# EAGLE design GS1011MWriter (EAGLE 6.5.0)
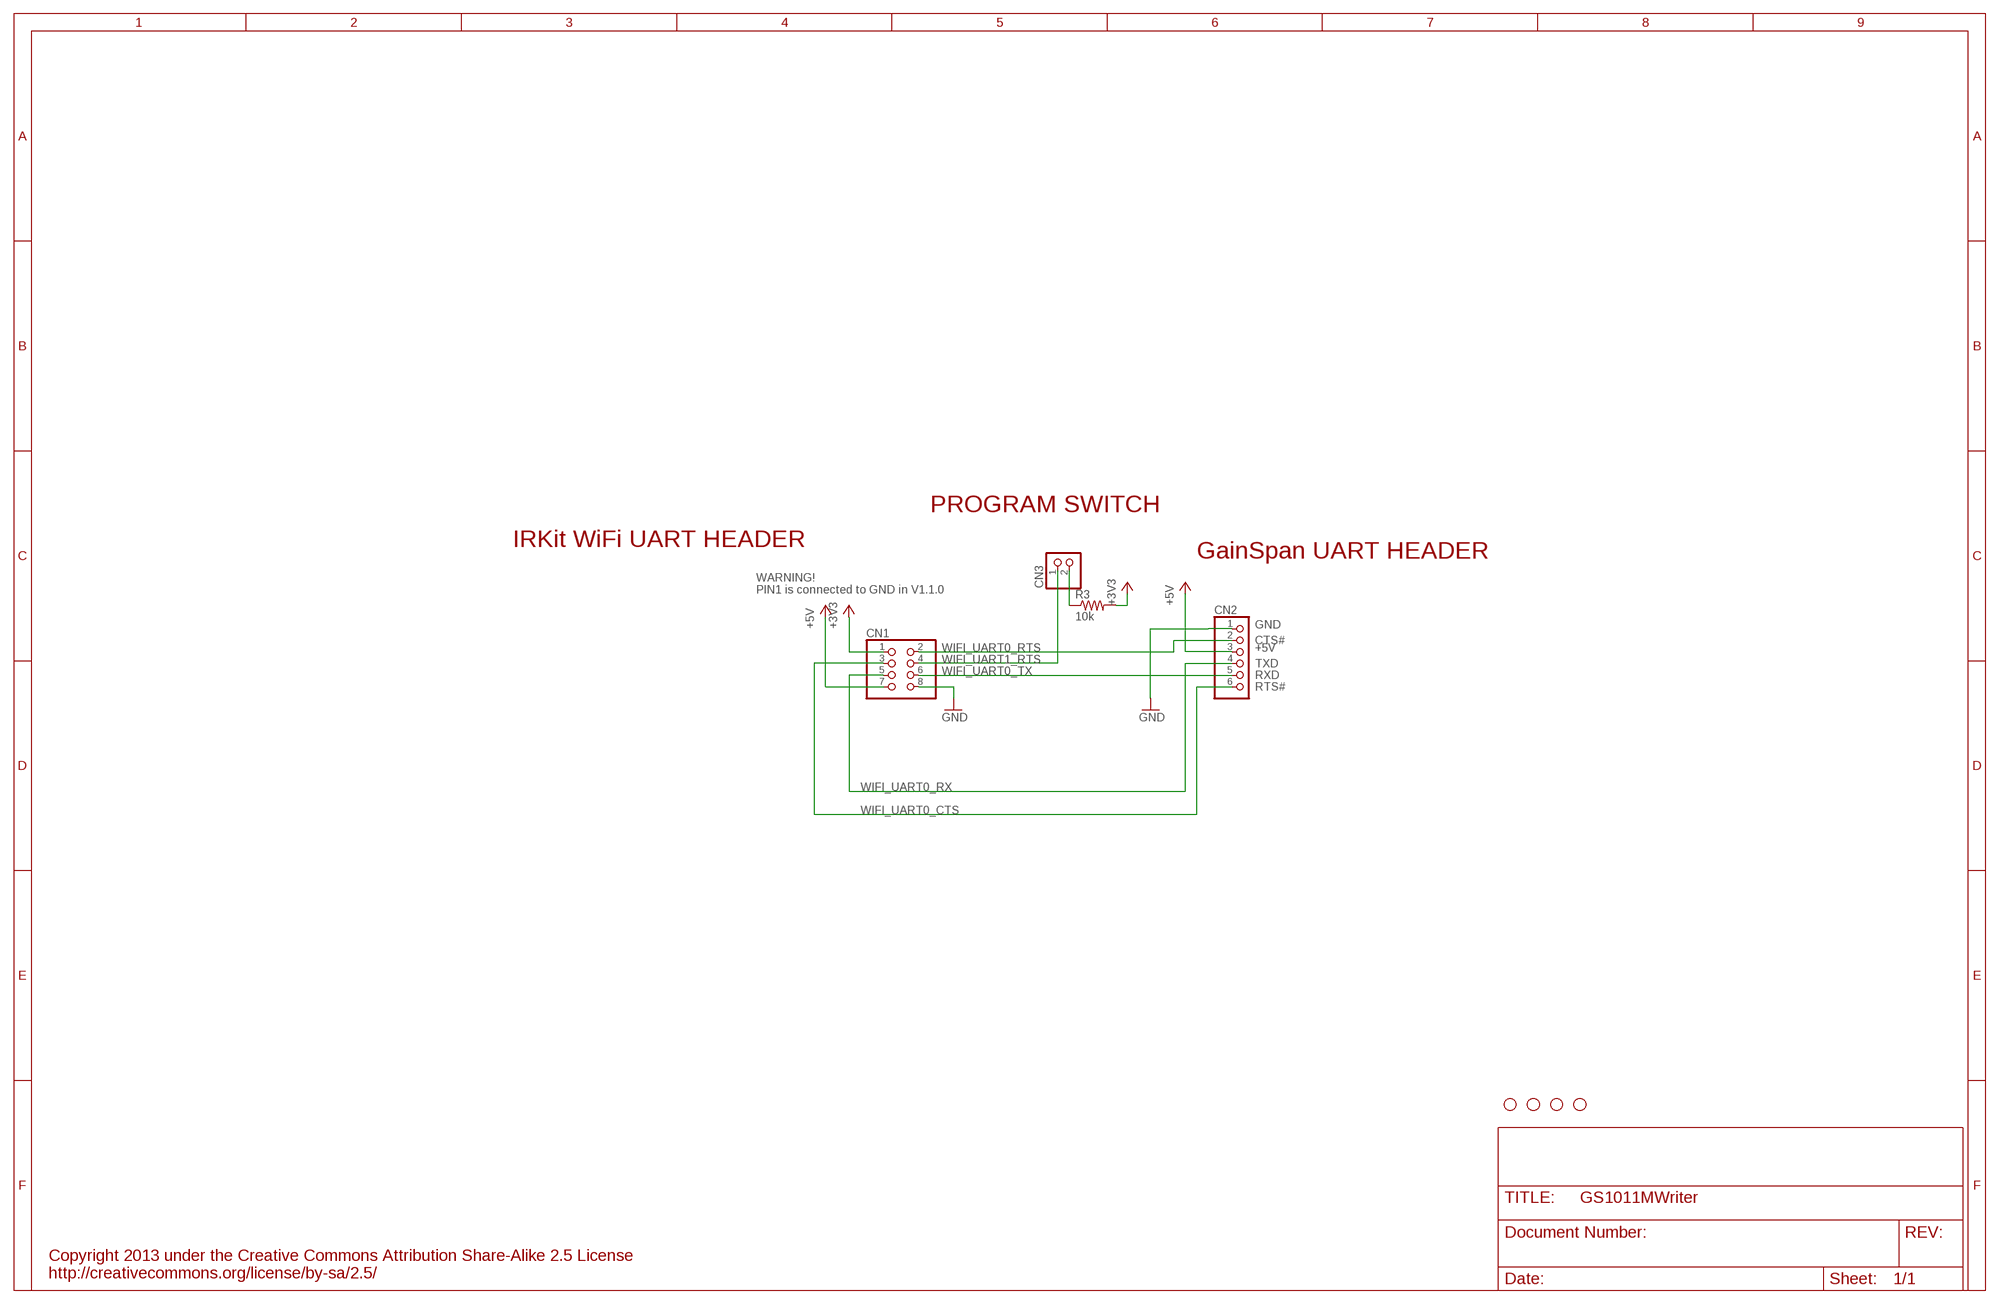
[diagram p0: schematic, sheet 1]

## Parts
CN1  PINHD-2X4  [2X04]
CN2  PINHD-1X6  [1X06]
CN3  PINHD-1X2  [1X02]
R3  10k  R  [2012]
STANDOFF1  STAND-OFF  [STAND-OFF]
STANDOFF2  STAND-OFF  [STAND-OFF]
STANDOFF3  STAND-OFF  [STAND-OFF]
STANDOFF4  STAND-OFF  [STAND-OFF]

## Nets
+3V3 [power]: CN1.1 R3.2
+5V [power]: CN1.7 CN2.3
GND [gnd]: CN1.8 CN2.1
N$1: CN3.2 R3.1
WIFI_UART0_CTS: CN1.3 CN2.6
WIFI_UART0_RTS: CN1.2 CN2.2
WIFI_UART0_RX: CN1.5 CN2.4
WIFI_UART0_TX: CN1.6 CN2.5
WIFI_UART1_RTS: CN1.4 CN3.1

## Notes on the sheet
- PROGRAM SWITCH
- IRKit WiFi UART HEADER
- GainSpan UART HEADER
- WARNING!
  PIN1 is connected to GND in V1.1.0
- CTS#
- TXD
- RXD
- RTS#
- Copyright 2013 under the Creative Commons Attribution Share-Alike 2.5 License
  http://creativecommons.org/license/by-sa/2.5/

## Library data of the parts
CN1 = pinhead:PINHD-2X4: PIN HEADER
CN2 = pinhead:PINHD-1X6: PIN HEADER
CN3 = pinhead:PINHD-1X2: PIN HEADER
R3 = my:R: RESISTOR
STANDOFF1-STANDOFF4 = my:STAND-OFF: #4 Stand Off This is the mechanical footprint for a #4 phillips button head screw. Use the keepout ring to avoid running the screw head into surrounding components. SKU : PRT-00447

## Net classes
0 default: width 0.254 mm
1 power: width 0.406 mm
2 ir-power: width 0.813 mm
3 gnd: width 0.406 mm
4 3.3v: width 0.406 mm

## Board
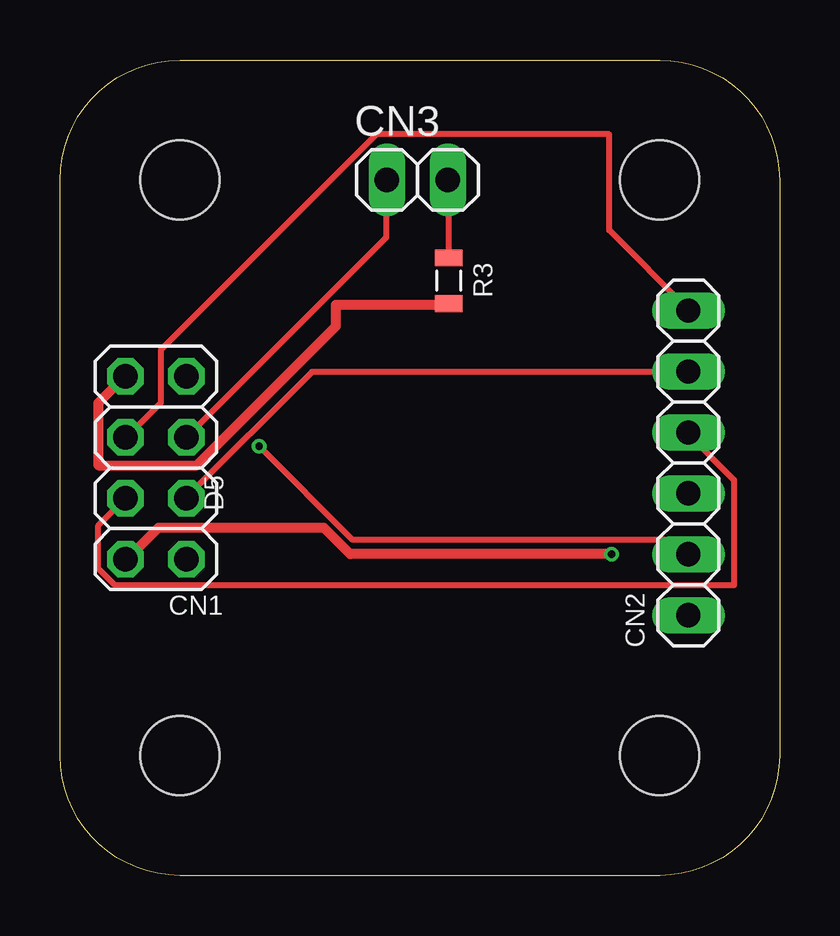
[diagram p1: board, top side]
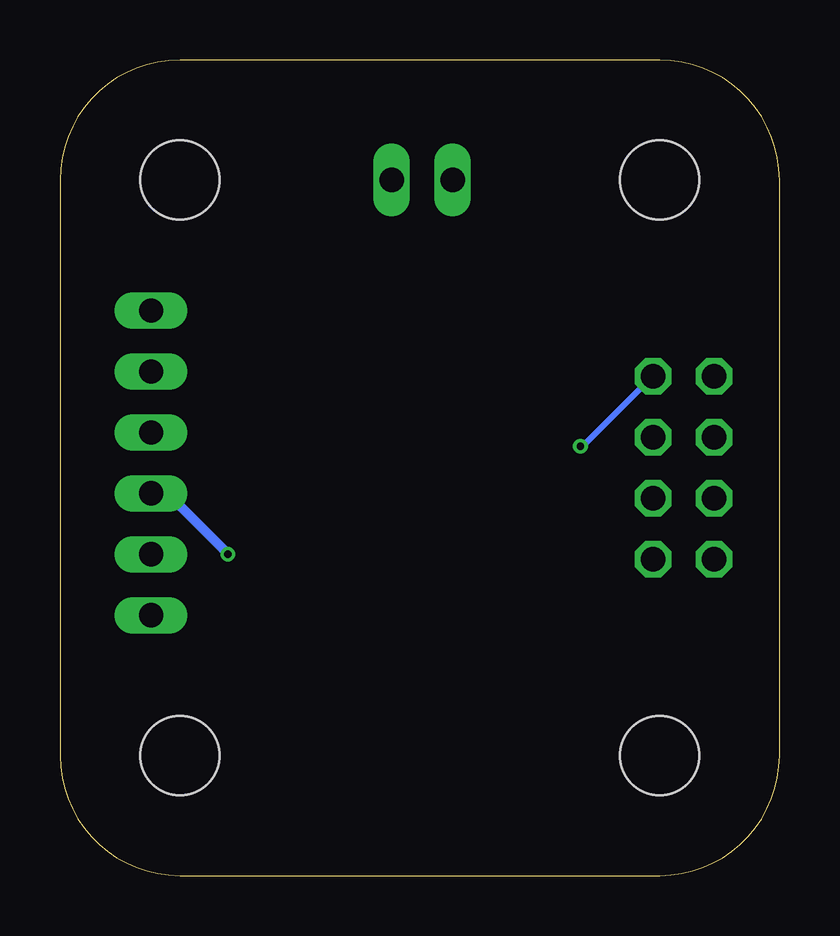
[diagram p2: board, bottom side, seen from below]

Size 30 x 34 mm. Coordinates in mm from the lower left corner, seen from the top.
Outline: 30,29 30,5 arc-90 25,0 5,0 arc-90 0,5 0,29 arc-90 5,34 25,34 arc-90 30,29
Copper layers (1*16): Top 0.035mm / dielectric 1.5mm / Bottom 0.035mm
Design rules "Fusion_eagle_rule_v1.1 *": minimum track width 6mil, minimum drill 12mil, track to track 6mil, track to pad 6mil, pad to pad 6mil, via to via 6mil, smd to smd 0mil, copper to edge 10mil, drill to drill 10mil, minimum pad ring 10mil, minimum via ring 6mil, stop-mask expansion 2mil, vias tented up to drill 100mil, thermal gap 10mil

### Footprints (pad centres in the part's own frame; a part is rotated, then mirrored left to right if it is on the bottom)
2X04 = drill 1.016 octagon: 1 -3.81,-1.27; 2 -3.81,1.27; 3 -1.27,-1.27; 4 -1.27,1.27; 5 1.27,-1.27; 6 1.27,1.27; 7 3.81,-1.27; 8 3.81,1.27
1X06 = drill 1.016 long: 1 -6.35,0; 2 -3.81,0; 3 -1.27,0; 4 1.27,0; 5 3.81,0; 6 6.35,0
1X02 = drill 1.016 long: 1 -1.27,0; 2 1.27,0
2012 = smd 0.7 x 1.15: 1 -0.95,0; 2 0.95,0
STAND-OFF = hole 3.302: 0,0

### Placement (x,y rotation side)
CN1  4,17 270 top
CN2  26.2,17.2 90 top
CN3  14.9,29 0 top
R3  16.2,24.8 270 top
STANDOFF1  5,5 0 top
STANDOFF2  5,29 0 top
STANDOFF3  25,5 0 top
STANDOFF4  25,29 0 top

### Tracks (layer width: path | path; a pad name or v marks a point on that pad's centre or on a via)
+3V3
  Top 0.406: R3.2 16.2,23.8 11.5,23.8 11.5,22.9 5.7,17.1 1.6,17.1 1.6,19.7 2.7,20.8 CN1.1
+5V  (via drill 0.3)
  Top 0.406: v23,13.4 12.1,13.4 11,14.5 4.1,14.5 2.8,13.2 CN1.7
  Bottom 0.406: v23,13.4 25.5,15.9 26.2,15.9 CN2.3
N$1
  Top 0.254: R3.1 16.2,25.8 16.2,29 CN3.2
WIFI_UART0_CTS
  Top 0.254: CN1.3 2.8,18.3 4.2,19.7 4.2,21.9 13.2,30.9 22.9,30.9 22.9,26.9 26.2,23.6 CN2.6
WIFI_UART0_RTS  (via drill 0.3)
  Top 0.254: v8.3,17.9 12.2,14 26.2,14 CN2.2
  Bottom 0.254: v8.3,17.9 8.2,17.9 5.3,20.8 CN1.2
WIFI_UART0_RX
  Top 0.254: CN1.5 2.7,15.7 1.6,14.6 1.6,12.8 2.3,12.1 28.1,12.1 28.1,16.5 26.2,18.4 CN2.4
WIFI_UART0_TX
  Top 0.254: CN1.6 5.3,15.8 10.5,21 CN2.5
WIFI_UART1_RTS
  Top 0.254: CN1.4 5.3,18.3 13.6,26.6 13.6,29 CN3.1

### Text on the board
tPlace: D5